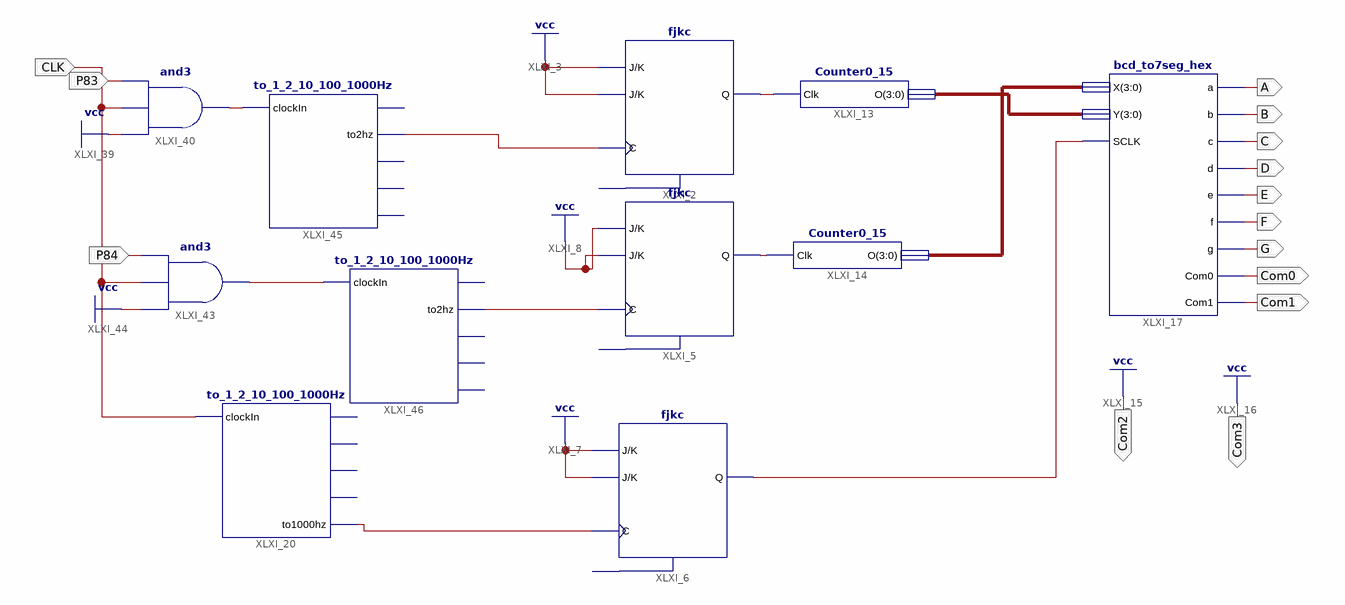
[diagram p0: schematic sheet 1]
// Xilinx ISE schematic main.sch (spartan6) as structural Verilog: 11 symbols, 14 ports
module main (
  input  CLK,
  input  P83,
  input  P84,
  output Com2,
  output Com3,
  output Com0,
  output G,
  output A,
  output B,
  output C,
  output D,
  output E,
  output F,
  output Com1
);

  wire XLXN_23, XLXN_24, XLXN_41, XLXN_87, XLXN_100, XLXN_101, XLXN_102, XLXN_104;
  wire [3:0] XLXN_44, XLXN_45;

  fjkc XLXI_2 (.C(XLXN_101), .J(1'b1), .K(1'b1), .Q(XLXN_23));  // open: CLR
  fjkc XLXI_6 (.C(XLXN_87), .J(1'b1), .K(1'b1), .Q(XLXN_41));  // open: CLR
  fjkc XLXI_5 (.C(XLXN_104), .J(1'b1), .K(1'b1), .Q(XLXN_24));  // open: CLR
  Counter0_15 XLXI_13 (.Clk(XLXN_23), .O(XLXN_44));
  Counter0_15 XLXI_14 (.Clk(XLXN_24), .O(XLXN_45));
  bcd_to7seg_hex XLXI_17 (
    .a(A), .b(B), .c(C), .Com0(Com0), .Com1(Com1), .d(D), .e(E), .f(F), .g(G), .SCLK(XLXN_41), .X(XLXN_45),
    .Y(XLXN_44));
  to_1_2_10_100_1000Hz XLXI_20 (.clockIn(CLK), .to1000hz(XLXN_87));  // open: to1hz, to2hz, to10hz, to100hz
  and XLXI_40 (XLXN_100, 1'b1, CLK, P83);
  and XLXI_43 (XLXN_102, 1'b1, CLK, P84);
  to_1_2_10_100_1000Hz XLXI_45 (.clockIn(XLXN_100), .to2hz(XLXN_101));  // open: to1hz, to10hz, to100hz, to1000hz
  to_1_2_10_100_1000Hz XLXI_46 (.clockIn(XLXN_102), .to2hz(XLXN_104));  // open: to1hz, to10hz, to100hz, to1000hz

  assign Com2 = 1'b1;
  assign Com3 = 1'b1;
endmodule
